# Altium schematic sheet SCH_SOURCE.SchDoc
size A; SheetNumber: 3; SheetTotal: 3
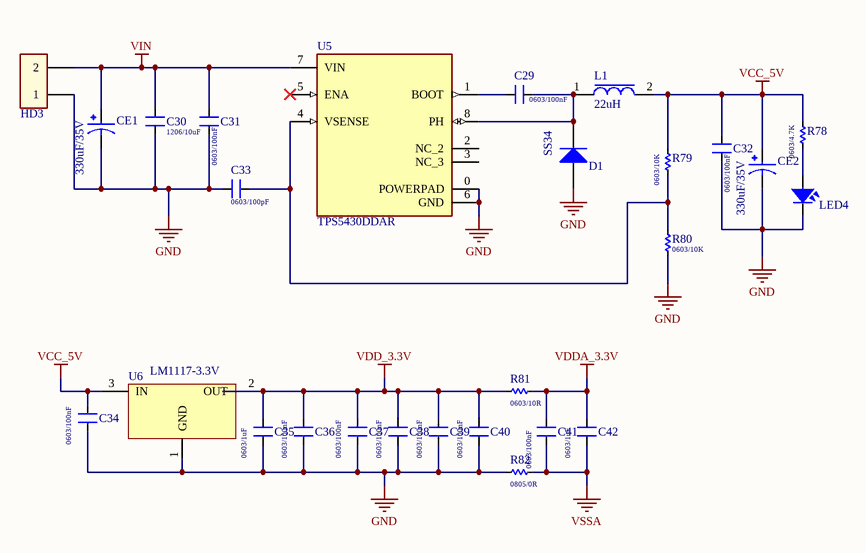
[diagram p0: SCH_SOURCE.SchDoc]

## Parts
C29  0603/100nF  [CAP-SMD-0603]
C30  1206/10uF  [CAP-SMD-1206]
C31  0603/100nF  [CAP-SMD-0603]
C32  0603/100nF  [CAP-SMD-0603]
C33  0603/100pF  [CAP-SMD-0603]
C34  0603/100nF  [CAP-SMD-0603]
C35  0603/1uF  [CAP-SMD-0603]
C36  0603/100nF  [CAP-SMD-0603]
C37  0603/100nF  [CAP-SMD-0603]
C38  0603/100nF  [CAP-SMD-0603]
C39  0603/100nF  [CAP-SMD-0603]
C40  0603/100nF  [CAP-SMD-0603]
C41  0603/100nF  [CAP-SMD-0603]
C42  0603/1uF  [CAP-SMD-0603]
CE1  330uF/35V  [CAP-DIP-8x16mm]
CE2  330uF/35V  [CAP-DIP-8x16mm]
D1  SS34  [SMB]
HD3  Header2  [XH2.54M-2]  (value not drawn)
L1  22uH  [L-SMD-M-7.3x4.5]
LED4  LED  [LED-0805-Green]  (value not drawn)
R78  0603/4.7K  [RES-SMD-0603]
R79  0603/10K  [RES-SMD-0603]
R80  0603/10K  [RES-SMD-0603]
R81  0603/10R  [RES-SMD-0603]
R82  0805/0R  [RES-SMD-0805]
U5  TPS5430DDAR  [SOP-8 + GND]
U6  LM1117-3.3V  [TO252-123]

## Nets
GND: C30.2 C31.2 C32.2 C33.1 C34.1 C35.1 C36.1 C37.1 C38.1 C39.1 C40.1 CE1.2 CE2.2 D1.1(A) HD3.1 LED4.2 R80.1 R82.1 U5.0(POWERPAD) U5.6(GND) U6.1(GND)
VCC_5V: C32.1 C34.2 CE2.1 L1.2 R78.1 R79.1 U6.3(IN)
VDD_3.3V: C35.2 C36.2 C37.2 C38.2 C39.2 C40.2 R81.1 U6.2(OUT)
VDDA_3.3V: C41.2 C42.2 R81.2
VIN: C30.1 C31.1 CE1.1 HD3.2 U5.7(VIN)
VSSA: C41.1 C42.1 R82.2
NetC29_1: C29.1 D1.2(K) L1.1 U5.8(PH)
NetC29_2: C29.2 U5.1(BOOT)
NetC33_2: C33.2 R79.2 R80.2 U5.4(VSENSE)
NetLED4_1: LED4.1 R78.2

Not connected (* = marked no-connect by the designer): U5 2(NC_2) 3(NC_3) 5(ENA)*

## Library data of the parts
C29-C42 = CAP-SMD: Value: 33pF
CE1 CE2 = CAP-ALU-DIP: 00077126; Value: 104; LatestRevisionDate: 17-Jul-2002; LatestRevisionNote: Re-released for DXP Platform.; PackageReference: C1206; Publisher: Altium Limited
D1 = Diode SMD: Default Diode; Code - JEDEC: DO-214-AB; Value: 1N5007; Published: 8-Jun-2000; Revision: July-2002: Re-released for DXP Platform.; Publisher: Altium Limited
L1 = L-SMD-1: partNo: 78477010; Manufacturer: Wurth Elektronik; Inductance: 1.0 μH; ComponentLink1Description: Manufacturer; ComponentLink1URL: http://www.we-online.de; Created by: Baojun Chen; Created Date: Nov.2015; ComponentLink2Description: Datasheet; ComponentLink2URL: http://katalog.we-online.de/pbs/datasheet/78477010.pdf
LED4 = LED1-SMD: Value: LED 3 - 5 ly 2 Colour
R78-R82 = Res-SMD: Resistor; Manufacturer: Generic Components; Class: Passive; Published: 08/06/2000; Publisher: Altium Hobart Technology Centre
U5 = TPS5430DDAR: 5.5V to 36V Input, 3A, 500kHz Step-Down Converter; MF: Texas Instruments; Package: HSOIC-8 Texas Instruments; Check_prices: https://www.snapeda.com/parts/TPS5430DDAR/Texas+Instruments/view-part/?ref=eda; Value: *; Purchase-URL: https://pricing.snapeda.com/search/part/TPS5430DDAR/?ref=eda; Availability: In Stock; SnapEDA_Link: https://www.snapeda.com/parts/TPS5430DDAR/Texas+Instruments/view-part/?ref=snap; MP: TPS5430DDAR; Price: None
U6 = IC LM1117: 800mA Low-Dropout Linear Regulator; Creator: Nguyen Ba Bien; Website: http://group3i.net